# EAGLE design PoppingUnit (EAGLE 6.5.0)
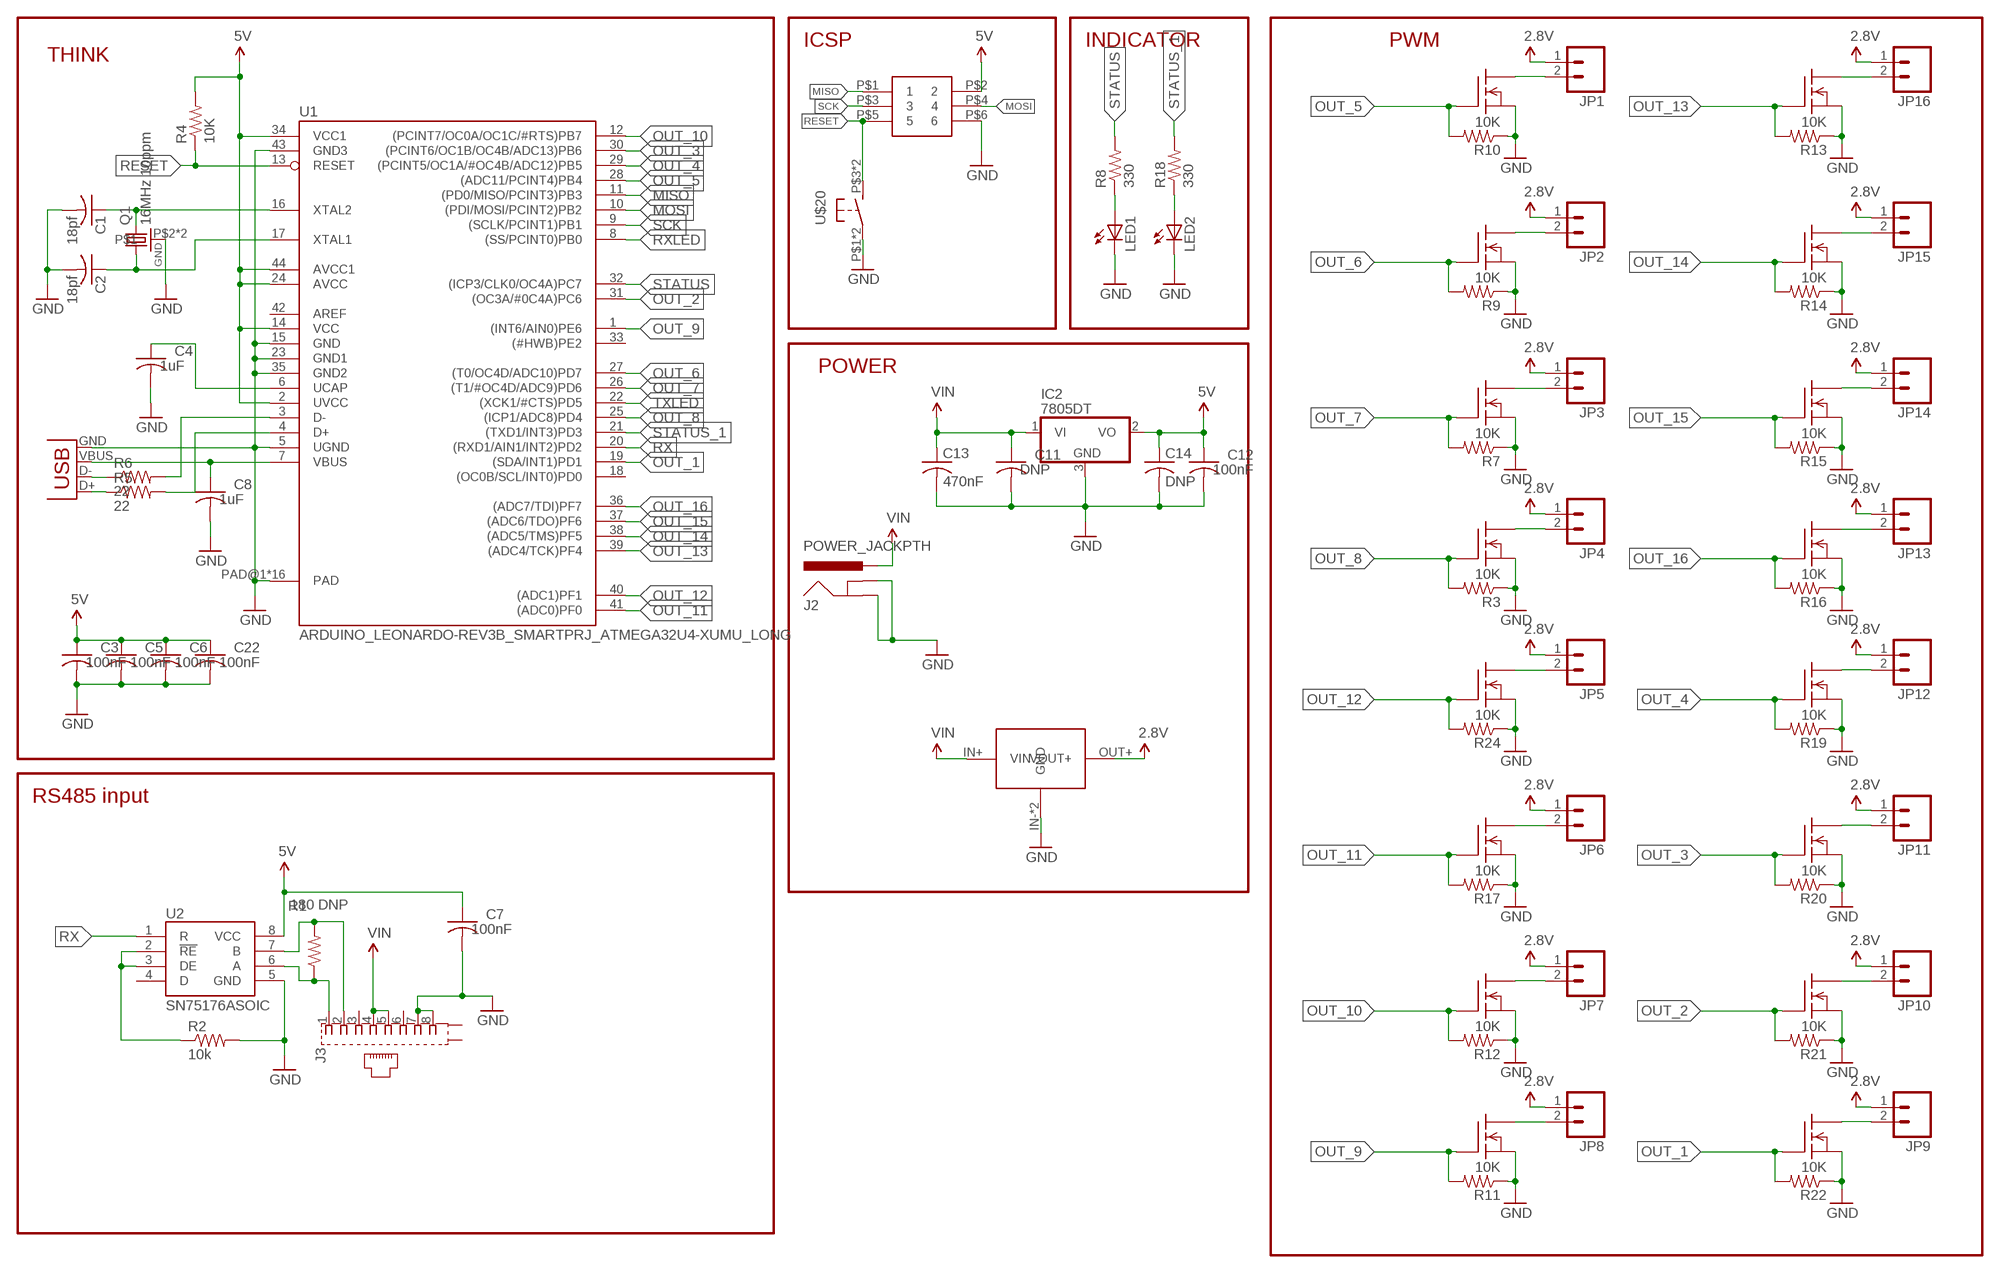
[diagram p0: schematic, sheet 1]

## Parts
C1  18pf  C-USC0603K  [C0603K]
C2  18pf  C-USC0603K  [C0603K]
C3  100nF  C-USC0603K  [C0603K]
C4  1uF  C-USC0603K  [C0603K]
C5  100nF  C-USC0603K  [C0603K]
C6  100nF  C-USC0603K  [C0603K]
C7  100nF  C-USC0603K  [C0603K]
C8  1uF  C-USC0603K  [C0603K]
C11  DNP  C-USC0603K  [C0603K]
C12  100nF  C-USC0603K  [C0603K]
C13  470nF  C-USC0603K  [C0603K]
C14  DNP  C-USC0603K  [C0603K]
C22  100nF  C-USC0603K  [C0603K]
IC2  7805DT  [TO252]
J2  POWER_JACKPTH  [POWER_JACK_PTH]
J3  555153-1  [555153-1]
JP1  M02-JST-2-PTH-NO_SILK  [JST-2-PTH-NS]
JP2  M02-JST-2-PTH-NO_SILK  [JST-2-PTH-NS]
JP3  M02-JST-2-PTH-NO_SILK  [JST-2-PTH-NS]
JP4  M02-JST-2-PTH-NO_SILK  [JST-2-PTH-NS]
JP5  M02-JST-2-PTH-NO_SILK  [JST-2-PTH-NS]
JP6  M02-JST-2-PTH-NO_SILK  [JST-2-PTH-NS]
JP7  M02-JST-2-PTH-NO_SILK  [JST-2-PTH-NS]
JP8  M02-JST-2-PTH-NO_SILK  [JST-2-PTH-NS]
JP9  M02-JST-2-PTH-NO_SILK  [JST-2-PTH-NS]
JP10  M02-JST-2-PTH-NO_SILK  [JST-2-PTH-NS]
JP11  M02-JST-2-PTH-NO_SILK  [JST-2-PTH-NS]
JP12  M02-JST-2-PTH-NO_SILK  [JST-2-PTH-NS]
JP13  M02-JST-2-PTH-NO_SILK  [JST-2-PTH-NS]
JP14  M02-JST-2-PTH-NO_SILK  [JST-2-PTH-NS]
JP15  M02-JST-2-PTH-NO_SILK  [JST-2-PTH-NS]
JP16  M02-JST-2-PTH-NO_SILK  [JST-2-PTH-NS]
LED1  LED5MM  [LED5MM]
LED2  LED5MM  [LED5MM]
Q1  16MHz 10ppm  CRYSTAL_4PAD2520  [CRSYTAL_2520]
R1  180 DNP  R-US_R0603  [R0603]
R2  10k  R-US_R0603  [R0603]
R3  10K  R-US_R0603  [R0603]
R4  10K  R-US_R0603  [R0603]
R5  22  R-US_R0603  [R0603]
R6  22  R-US_R0603  [R0603]
R7  10K  R-US_R0603  [R0603]
R8  330  R-US_R0603  [R0603]
R9  10K  R-US_R0603  [R0603]
R10  10K  R-US_R0603  [R0603]
R11  10K  R-US_R0603  [R0603]
R12  10K  R-US_R0603  [R0603]
R13  10K  R-US_R0603  [R0603]
R14  10K  R-US_R0603  [R0603]
R15  10K  R-US_R0603  [R0603]
R16  10K  R-US_R0603  [R0603]
R17  10K  R-US_R0603  [R0603]
R18  330  R-US_R0603  [R0603]
R19  10K  R-US_R0603  [R0603]
R20  10K  R-US_R0603  [R0603]
R21  10K  R-US_R0603  [R0603]
R22  10K  R-US_R0603  [R0603]
R24  10K  R-US_R0603  [R0603]
U1  ARDUINO_LEONARDO-REV3B_SMARTPRJ_ATMEGA32U4-XUMU_LONG  [QFN44ML7X7_LONGLEADS]
U2  SN75176ASOIC  [SO08]
U$1  N_MOSFET  [TO252]
U$2  2X3HEADER  [2X3HEADER]
U$3  N_MOSFET  [TO252]
U$4  N_MOSFET  [TO252]
U$5  N_MOSFET  [TO252]
U$6  N_MOSFET  [TO252]
U$7  N_MOSFET  [TO252]
U$8  N_MOSFET  [TO252]
U$9  N_MOSFET  [TO252]
U$10  N_MOSFET  [TO252]
U$11  N_MOSFET  [TO252]
U$12  N_MOSFET  [TO252]
U$14  N_MOSFET  [TO252]
U$15  N_MOSFET  [TO252]
U$16  N_MOSFET  [TO252]
U$17  N_MOSFET  [TO252]
U$18  N_MOSFET  [TO252]
U$19  DC_DC  [DSN2596]
U$20  BUTTON_MOMENTARY  [BUTTON_MOMENTARY_KMR211G]
X1  USBPTH  [USB-B-PTH]

## Nets
2.8V: JP1.1 JP2.1 JP3.1 JP4.1 JP5.1 JP6.1 JP7.1 JP8.1 JP9.1 JP10.1 JP11.1 JP12.1 JP13.1 JP14.1 JP15.1 JP16.1 U$19.OUT+(VOUT+)
5V: C3.1 C5.1 C6.1 C7.1 C12.1 C14.1 C22.1 IC2.2(VO) R4.2 U1.2(UVCC) U1.14(VCC) U1.24(AVCC) U1.34(VCC1) U1.44(AVCC1) U2.8(VCC) U$2.P$2
CONNECT_ME: R2.1 U2.2(!RE) U2.3(DE)
GND [power]: C1.2 C2.2 C3.2 C4.2 C5.2 C6.2 C7.2 C8.2 C11.2 C12.2 C13.2 C14.2 C22.2 IC2.3(GND) J2.GND J2.GNDBREAK J3.7 J3.8 LED1.K(C) LED2.K(C) Q1.P$2 Q1.P$4 R2.2 R3.1 R7.1 R9.1 R10.1 R11.1 R12.1 R13.1 R14.1 R15.1 R16.1 R17.1 R19.1 R20.1 R21.1 R22.1 R24.1 U1.5(UGND) U1.15(GND) U1.23(GND1) U1.35(GND2) U1.43(GND3) U1.PAD@1(PAD) U1.PAD@2(PAD) U1.PAD@3(PAD) U1.PAD@4(PAD) U1.PAD@5(PAD) U1.PAD@6(PAD) U1.PAD@7(PAD) U1.PAD@8(PAD) U1.PAD@9(PAD) U1.PAD@10(PAD) U1.PAD@11(PAD) U1.PAD@12(PAD) U1.PAD@13(PAD) U1.PAD@14(PAD) U1.PAD@15(PAD) U1.PAD@16(PAD) U2.5(GND) U$1.P$2(S) U$2.P$6 U$3.P$2(S) U$4.P$2(S) U$5.P$2(S) U$6.P$2(S) U$7.P$2(S) U$8.P$2(S) U$9.P$2(S) U$10.P$2(S) U$11.P$2(S) U$12.P$2(S) U$14.P$2(S) U$15.P$2(S) U$16.P$2(S) U$17.P$2(S) U$18.P$2(S) U$19.IN-(GND) U$19.OUT-(GND) U$20.P$1(P) U$20.P$2(P) X1.GND
MISO: U1.11((PD0/MISO/PCINT3)PB3) U$2.P$1
MOSI: U1.10((PDI/MOSI/PCINT2)PB2) U$2.P$4
N$1: R6.1 X1.D-
N$2: C1.1 Q1.P$3 U1.16(XTAL2)
N$3: R5.1 X1.D+
N$4: R5.2 U1.4(D+)
N$5: C2.1 Q1.P$1 U1.17(XTAL1)
N$6: R6.2 U1.3(D-)
N$7: C8.1 U1.7(VBUS) X1.VBUS
N$8: LED1.A R8.1
N$9: C4.1 U1.6(UCAP)
N$10: JP11.2 U$16.P$3(D)
N$11: JP1.2 U$1.P$3(D)
N$12: LED2.A R18.1
N$22: JP2.2 U$3.P$3(D)
N$23: JP3.2 U$4.P$3(D)
N$24: JP4.2 U$5.P$3(D)
N$25: JP5.2 U$10.P$3(D)
N$26: JP6.2 U$11.P$3(D)
N$27: JP7.2 U$12.P$3(D)
N$28: JP8.2 U$14.P$3(D)
N$29: JP9.2 U$18.P$3(D)
N$30: JP10.2 U$17.P$3(D)
N$32: JP12.2 U$15.P$3(D)
N$33: JP13.2 U$9.P$3(D)
N$34: JP14.2 U$8.P$3(D)
N$35: JP15.2 U$7.P$3(D)
N$36: JP16.2 U$6.P$3(D)
OUT_1: R22.2 U1.19((SDA/INT1)PD1) U$18.P$1(G)
OUT_2: R21.2 U1.31((OC3A/#0C4A)PC6) U$17.P$1(G)
OUT_3: R20.2 U1.30((PCINT6/OC1B/OC4B/ADC13)PB6) U$16.P$1(G)
OUT_4: R19.2 U1.29((PCINT5/OC1A/#OC4B/ADC12)PB5) U$15.P$1(G)
OUT_5: R10.2 U1.28((ADC11/PCINT4)PB4) U$1.P$1(G)
OUT_6: R9.2 U1.27((T0/OC4D/ADC10)PD7) U$3.P$1(G)
OUT_7: R7.2 U1.26((T1/#OC4D/ADC9)PD6) U$4.P$1(G)
OUT_8: R3.2 U1.25((ICP1/ADC8)PD4) U$5.P$1(G)
OUT_9: R11.2 U1.1((INT6/AIN0)PE6) U$14.P$1(G)
OUT_10: R12.2 U1.12((PCINT7/OC0A/OC1C/#RTS)PB7) U$12.P$1(G)
OUT_11: R17.2 U1.41((ADC0)PF0) U$11.P$1(G)
OUT_12: R24.2 U1.40((ADC1)PF1) U$10.P$1(G)
OUT_13: R13.2 U1.39((ADC4/TCK)PF4) U$6.P$1(G)
OUT_14: R14.2 U1.38((ADC5/TMS)PF5) U$7.P$1(G)
OUT_15: R15.2 U1.37((ADC6/TDO)PF6) U$8.P$1(G)
OUT_16: R16.2 U1.36((ADC7/TDI)PF7) U$9.P$1(G)
RESET: R4.1 U1.13(RESET) U$2.P$5 U$20.P$3(S) U$20.P$4(S)
RS485A: J3.1 R1.1 U2.6(A)
RS485B: J3.2 R1.2 U2.7(B)
RX: U1.20((RXD1/AIN1/INT2)PD2) U2.1(R)
RXLED: U1.8((SS/PCINT0)PB0)
SCK: U1.9((SCLK/PCINT1)PB1) U$2.P$3
STATUS: R8.2 U1.32((ICP3/CLK0/OC4A)PC7)
STATUS_1: R18.2 U1.21((TXD1/INT3)PD3)
TXLED: U1.22((XCK1/#CTS)PD5)
VIN: C11.1 C13.1 IC2.1(VI) J2.PWR J3.4 J3.5 U$19.IN+(VIN)
Unconnected: J3.3 J3.6 J3.G1(S1) J3.G2(S2) U1.18((OC0B/SCL/INT0)PD0) U1.33((#HWB)PE2) U2.4(D)

## Notes on the sheet
- ICSP | INDICATOR | PWM
- THINK
- POWER
- RS485 input

## Power pins joined to a net without a drawn wire
AREF: U1.42(AREF)

## Library data of the parts
C1-C8 C11-C14 C22 = adafruit:C-US: CAPACITOR, American symbol
IC2 = linear:78*: Positive VOLTAGE REGULATOR Source: http://cache.national.com/ds/LM/LM78L05.pdf http://www.fairchildsemi.com/ds/LM/LM7805.pdf
J2 = SparkFun:POWER_JACK: Power Jack This is the standard 5.5mm barrel jack for power. The PTH is the most common, proven, reliable, footprint. All others are experimental. The Slot footprint only works if the mill layer is transmitted to the PCB fab house so be warned. Spark Fun Electronics SKU : PRT-00119. Mating wall wart : TOL-00298 (and others)
J3 = con-amp:555153-1: AMP connector
JP1-JP16 = SparkFun-Connectors:M02: Header 2 Standard 2-pin 0.1" header. Use with straight break away headers (SKU : PRT-00116), right angle break away headers (PRT-00553), swiss pins (PRT-00743), machine pins (PRT-00117), and female headers (PRT-00115). Molex polarized connector foot print use with SKU : PRT-08233 with associated crimp pins and housings.
LED1 LED2 = SparkFun:LED: LEDs Standard schematic elements and footprints for 5mm, 3mm, 1206, and 0603 sized LEDs. 5mm - Spark Fun Electronics SKU : COM-00529 (and others)
Q1 = blinkinlabs:CRYSTAL_4PAD
R1-R22 R24 = adafruit:R-US_: RESISTOR, American symbol
U1 = blinkinlabs:ARDUINO_LEONARDO-REV3B_SMARTPRJ_ATMEGA32U4-XU
U2 = reprap:SN75176A
U$1 U$3-U$12 U$14-U$18 = blinkinlabs:N_MOSFET
U$2 = sonos_library:2X3HEADER
U$19 = blinkinlabs:DC_DC
U$20 = blinkinlabs:BUTTON_MOMENTARY
X1 = SparkFun:USB: USB Connectors USB-B-PTH is fully proven SKU : PRT-00139 USB-miniB is fully proven SKU : PRT-00587 USB-A-PCB is untested. USB-A-H is throughly reviewed, but untested. Spark Fun Electronics SKU : PRT-00437 USB-B-SMT is throughly reviewed, but untested. Needs silkscreen touching up. USB-A-S has not been used/tested USB-MB-H has not been used/tested

## Net classes
0 default: width 0.254 mm
1 power: width 0.406 mm
2 motors: width 0.61 mm

## Board
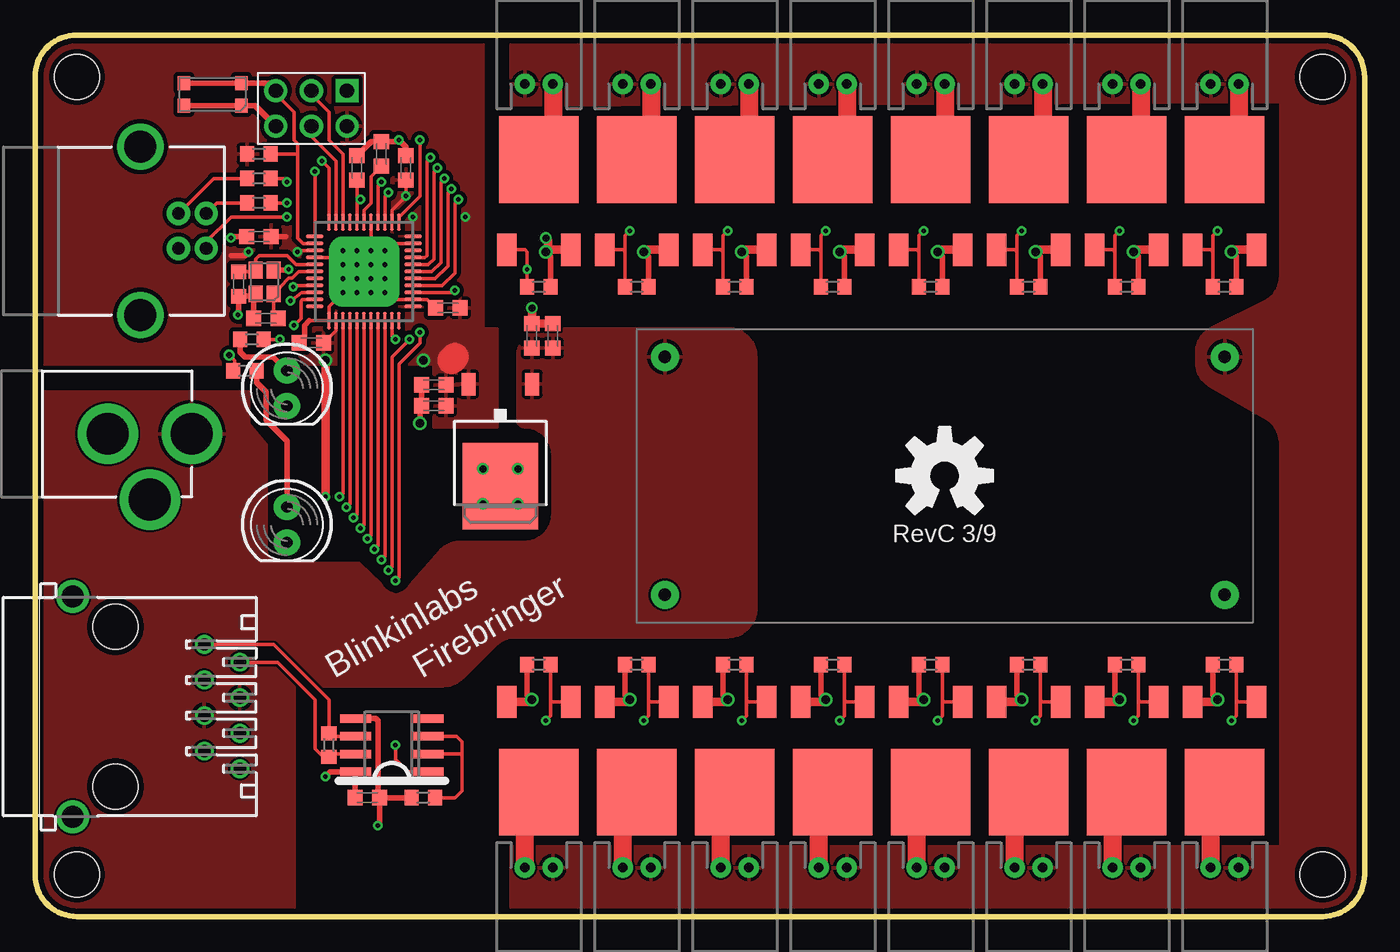
[diagram p1: board, top side]
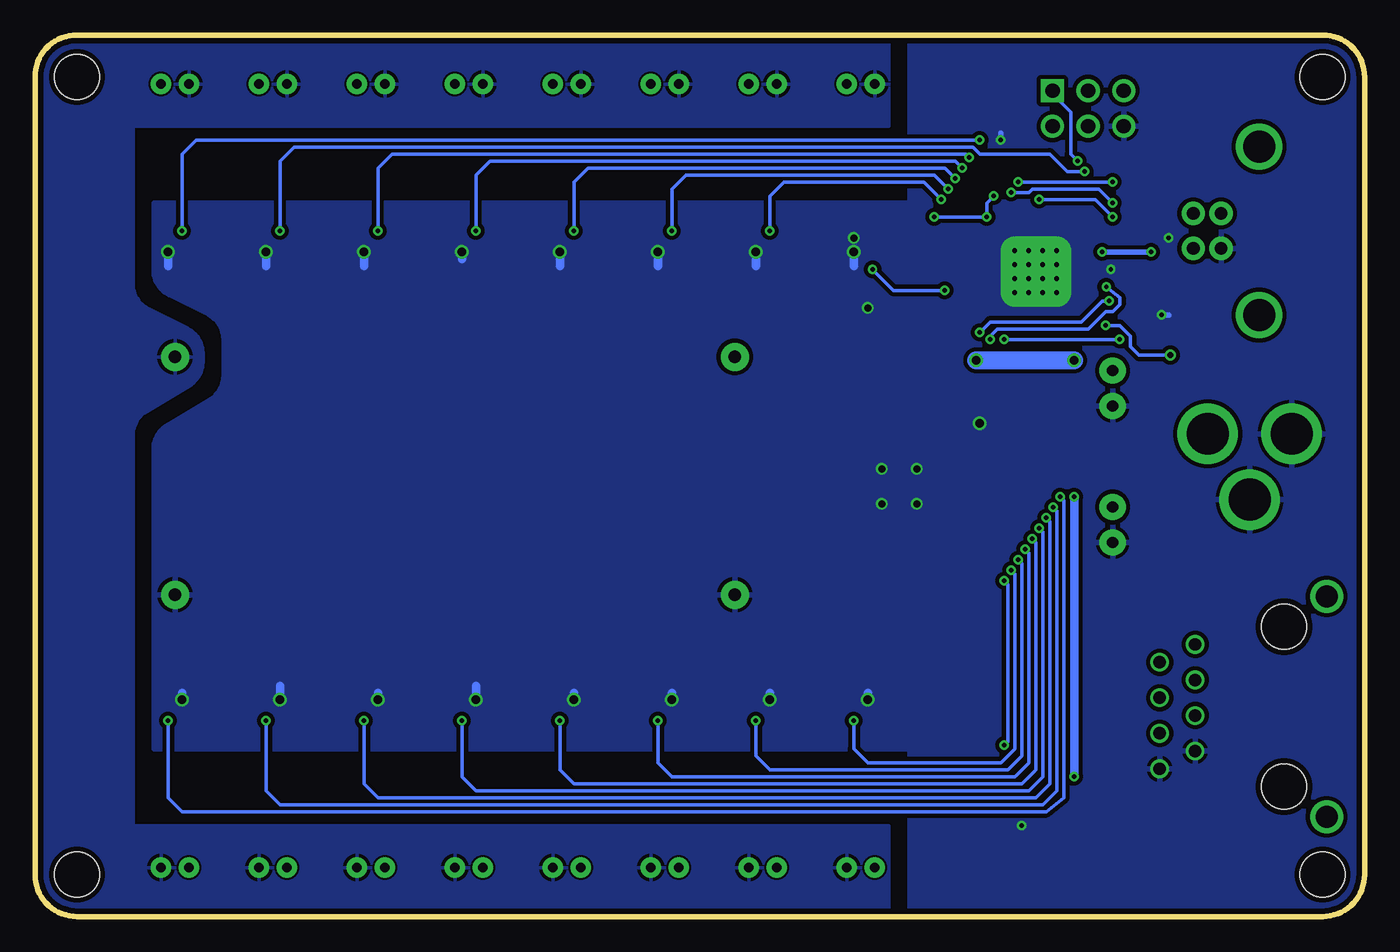
[diagram p2: board, bottom side, seen from below]

Size 95 x 63 mm. Coordinates in mm from the lower left corner, seen from the top.
Outline: 3,63 92,63 arc-90 95,60 95,3 arc-90 92,0 3,0 arc-90 0,3 0,60 arc-90 3,63
Copper layers (1*16): Top 0.0356mm / dielectric 1.5011mm / Bottom 0.0356mm
Design rules "default *": minimum track width 6mil, minimum drill 0.3mm, track to track 6mil, track to pad 6mil, pad to pad 6mil, via to via 6mil, smd to smd 6mil, copper to edge 15mil, drill to drill 6mil, minimum pad ring 7mil, minimum via ring 7mil, stop-mask expansion 4mil, vias tented up to drill 0.3mm, thermal gap 10mil
Holes 3.2 mm at 3,3 3,60 92,60 92,3

### Footprints (pad centres in the part's own frame; a part is rotated, then mirrored left to right if it is on the bottom)
C0603K = smd 1.05 x 1.08: 1 -0.875,0; 2 0.875,0
TO252 = smd 1 x 1.6: 1 -2.28,-4.8; 2 2.28,-4.8 | smd 5.4 x 6.2: 3 0,2.5
POWER_JACK_PTH = drill 2.997 pad 4.318: GND 0,7.7; GNDBREAK 4.7,10.7; PWR 0,13.7
555153-1 = drill 0.889: 1 -4.445,6.35; 2 -3.175,8.89; 3 -1.905,6.35; 4 -0.635,8.89; 5 0.635,6.35; 6 1.905,8.89; 7 3.175,6.35; 8 4.445,8.89 | drill 1.575 pad 2.184: G1 -7.874,-3.048; G2 7.874,-3.048 | hole 3.251: -5.715,0; 5.715,0
JST-2-PTH-NS = drill 0.7 pad 1.448: 1 -1,0; 2 1,0
LED5MM = drill 0.813 pad 1.88: A -1.27,0; K 1.27,0
CRSYTAL_2520 = smd 1.2 x 1: P$1 -0.85,-0.65; P$2 0.85,-0.65; P$3 0.85,0.65; P$4 -0.85,0.65
R0603 = smd 1 x 1.1: 1 -0.85,0; 2 0.85,0
QFN44ML7X7_LONGLEADS = smd 1.25 x 0.275: 1 -3.525,2.5; 2 -3.525,2; 3 -3.525,1.5; 4 -3.525,1; 5 -3.525,0.5; 6 -3.525,0; 7 -3.525,-0.5; 8 -3.525,-1; 9 -3.525,-1.5; 10 -3.525,-2; 11 -3.525,-2.5; 23 3.525,-2.5; 24 3.525,-2; 25 3.525,-1.5; 26 3.525,-1; 27 3.525,-0.5; 28 3.525,0; 29 3.525,0.5; 30 3.525,1; 31 3.525,1.5; 32 3.525,2; 33 3.525,2.5 | smd 0.275 x 1.25: 12 -2.5,-3.525; 13 -2,-3.525; 14 -1.5,-3.525; 15 -1,-3.525; 16 -0.5,-3.525; 17 0,-3.525; 18 0.5,-3.525; 19 1,-3.525; 20 1.5,-3.525; 21 2,-3.525; 22 2.5,-3.525; 34 2.5,3.525; 35 2,3.525; 36 1.5,3.525; 37 1,3.525; 38 0.5,3.525; 39 0,3.525; 40 -0.5,3.525; 41 -1,3.525; 42 -1.5,3.525; 43 -2,3.525; 44 -2.5,3.525 | drill 0.35 pad 2: PAD@1 -1.5,1.5; PAD@4 1.5,1.5; PAD@13 -1.5,-1.5; PAD@16 1.5,-1.5 | drill 0.35 pad 2 square: PAD@2 -0.5,1.5; PAD@3 0.5,1.5; PAD@5 -1.5,0.5; PAD@8 1.5,0.5; PAD@9 -1.5,-0.5; PAD@12 1.5,-0.5; PAD@14 -0.5,-1.5; PAD@15 0.5,-1.5 | drill 0.35 pad 1 square: PAD@6 -0.5,0.5; PAD@7 0.5,0.5; PAD@10 -0.5,-0.5; PAD@11 0.5,-0.5
SO08 = smd 0.6 x 2.2: 1 -1.905,-2.6; 2 -0.635,-2.6; 3 0.635,-2.6; 4 1.905,-2.6; 5 1.905,2.6; 6 0.635,2.6; 7 -0.635,2.6; 8 -1.905,2.6
TO252' = smd 1.4 x 2.3: P$1 -2.285,-3.35; P$2 2.285,-3.35 | smd 5.7 x 6.2: P$3 0,3.1
2X3HEADER = drill 1.016 pad 1.651 square: P$1 -1.27,2.54 | drill 1.016 pad 1.651: P$2 1.27,2.54; P$3 -1.27,0; P$4 1.27,0; P$5 -1.27,-2.54; P$6 1.27,-2.54
DSN2596 = drill 0.9 pad 2: IN+ -20,8.5; IN- -20,-8.5; OUT+ 20,8.5; OUT- 20,-8.5
BUTTON_MOMENTARY_KMR211G = smd 0.9 x 1: P$1 -2,0.8; P$2 2.1,0.8; P$3 -2,-0.8; P$4 2.1,-0.8
USB-B-PTH = drill 0.914 pad 1.676: D+ 0,1.25; D- 1.981,1.25; GND 0,-1.25; VBUS 1.981,-1.25 | drill 2.286: S1 -2.718,-6.02; S2 -2.718,6.02

### Placement (x,y rotation side)
C1  14.55,45.2 270 top
C2  16.5,42.75 180 top
C3  26.5,53.5 90 top
C4  24.75,54.5 90 top
C5  29.5,43.5 180 top
C6  16,48.6 180 top
C7  23.75,8.5 0 top
C8  23,53.5 90 top
C11  37,41.5 90 top
C12  28.5,36.5 180 top
C13  35.5,41.5 90 top
C14  28.5,38 180 top
C22  19.75,41 180 top
IC2  33.25,33.25 180 top
J2  -2.5,34.5 270 top
J3  5.75,15 270 top
JP1  64,3.5 180 top
JP2  71,3.5 180 top
JP3  78,3.5 180 top
JP4  85,3.5 180 top
JP5  64,59.5 0 top
JP6  71,59.5 0 top
JP7  78,59.5 0 top
JP8  85,59.5 0 top
JP9  36,3.5 180 top
JP10  43,3.5 180 top
JP11  50,3.5 180 top
JP12  57,3.5 180 top
JP13  36,59.5 0 top
JP14  43,59.5 0 top
JP15  50,59.5 0 top
JP16  57,59.5 0 top
LED1  18,37.75 270 top
LED2  18,28 270 top
Q1  16.4,45.35 90 top
R1  21,12.25 270 top
R2  27.75,8.5 180 top
R3  85,18 0 top
R4  16,54.5 180 top
R5  16,52.75 0 top
R6  16,51 0 top
R7  78,18 0 top
R8  15.5,41.25 0 top
R9  71,18 0 top
R10  64,18 0 top
R11  85,45 180 top
R12  78,45 180 top
R13  57,45 180 top
R14  50,45 180 top
R15  43,45 180 top
R16  36,45 180 top
R17  71,45 180 top
R18  15,39 180 top
R19  57,18 0 top
R20  50,18 0 top
R21  43,18 0 top
R22  36,18 0 top
R24  64,45 180 top
U1  23.5,46.1 270 top
U2  25.5,12.25 90 top
U$1  N_MOSFET  [TO252']  64,12 180 top
U$2  19.75,57.75 270 top
U$3  N_MOSFET  [TO252']  71,12 180 top
U$4  N_MOSFET  [TO252']  78,12 180 top
U$5  N_MOSFET  [TO252']  85,12 180 top
U$6  N_MOSFET  [TO252']  57,51 0 top
U$7  N_MOSFET  [TO252']  50,51 0 top
U$8  N_MOSFET  [TO252']  43,51 0 top
U$9  N_MOSFET  [TO252']  36,51 0 top
U$10  N_MOSFET  [TO252']  64,51 0 top
U$11  N_MOSFET  [TO252']  71,51 0 top
U$12  N_MOSFET  [TO252']  78,51 0 top
U$13  [OSHW-LOGO-L]  65,31.5 0 top
U$14  N_MOSFET  [TO252']  85,51 0 top
U$15  N_MOSFET  [TO252']  57,12 180 top
U$16  N_MOSFET  [TO252']  50,12 180 top
U$17  N_MOSFET  [TO252']  43,12 180 top
U$18  N_MOSFET  [TO252']  36,12 180 top
U$19  65,31.5 0 top
U$20  12.75,58.75 180 top
X1  10.25,49 0 top

### Tracks (layer width: path | path; a pad name or v marks a point on that pad's centre or on a via)
2.8V
  pour Bottom: 34,63 92,63 arc-90 95,60 95,3 arc-90 92,0 34,0 34,6.5 88,6.5 88,34.37 arc59 87.03,36.08 83.97,37.92 arc-59 83,39.63 83,40.26 arc-63 84.11,42.05 86.89,43.45 arc63 88,45.24 88,56.5 34,56.5
  pour Top: 34,63 92,63 arc-90 95,60 95,3 arc-90 92,0 34,0 34,5 89,5 89,33.85 arc60 88.01,35.58 83.99,37.92 arc-60 83,39.65 83,40.26 arc-63 84.11,42.05 87.89,43.95 arc63 89,45.74 89,58.25 34,58
5V  (via drill 0.3, 0.6)
  Top 0.254: U1.2 25.5,50.5 v26.5,51.5 C3.1 | 18.9,47.6 v18.75,47.5 18.6,47.6 U1.14 | U1.24 21.5,41.88 C22.1
  Top 0.406: v20.75,10 21.09,10.35 U2.8 22.88,10.32 C7.1 | C6.1 17.9,48.6 | v15.25,47.5 15,47.25 14,47.25
  Top 0.61: v20.75,30 v20.75,39.75
  Top 2: 29.75,39.75 30,40
  Bottom 0.254: v26.5,51.5 27,51 v27,50 v30.75,50
  Bottom 0.406: v18.75,47.5 v15.25,47.5
  Bottom 0.61: v20.75,10 v20.75,30
  Bottom 1.27: v20.75,39.75 v27.75,39.75
  pour Top (isolate 0.3): 0,39.5 0,60 arc-90 3,63 32,63 32,42 33,42 33,35 28.5,35 28.5,39.5
CONNECT_ME
  Top 0.254: R2.1 30,8.5 30.5,9 30.5,11.5 | 30.5,11.5 30.5,12.5 30.11,12.88 U2.3 | U2.2 30.39,11.62 30.5,11.5
GND  (via drill 0.3, 0.5, 0.6)
  Top 0.254: U1.43 25.5,48.1 U1.PAD@1 | U1.15 21.5,47.1 U1.PAD@14 | U1.PAD@16 21,43.6 U1.23 19.57,42.58 | U1.PAD@4 25.5,44.1 U1.35 28.02,44.1 C5.2 | U1.5 U1.PAD@5
  Top 0.406: R22.1 35.15,15.85 v35.5,15.5 | R21.1 42.15,15.85 v42.5,15.5 | R20.1 49.15,15.85 v49.5,15.5 | R19.1 56.15,15.85 v56.5,15.5 | R10.1 63.15,15.85 v63.5,15.5 | R9.1 70.15,15.85 v70.5,15.5 | R7.1 77.15,15.85 v77.5,15.5 | R3.1 84.15,15.85 v84.5,15.5 | R11.1 85.85,47.15 v85.5,47.5 | R12.1 78.85,47.15 v78.5,47.5 | R17.1 71.85,47.15 v71.5,47.5 | R24.1 64.85,47.15 v64.5,47.5 | R13.1 57.85,47.15 v57.5,47.5 | R14.1 50.85,47.15 v50.5,47.5 | R15.1 43.85,47.15 v43.5,47.5 | R16.1 36.85,47.15 v36.5,47.5 | C7.2 24.62,6.62 v24.5,6.5 | U2.5 24.34,14.15 24.5,14 24.5,8.62 C7.2 | R2.2 C7.2 | v14.5,43 14.55,43.05 C1.2 15.57,44.33 Q1.P$4 15.62,44.38 C2.2 | Q1.P$2 17.8,46.2 v18.12,46.25 | v34.5,29.5 IC2.3 | C8.2 24,55.38 C4.2 25.88,55.38 v26,55.5 26.5,55 C3.2 | v27.5,35.25 27.5,36.38 C12.2 C14.2 | C6.2 14.1,48.6 v14,48.5 | U$2.P$6 15.74,57.95 U$20.P$1 U$20.P$2 | 19.57,42.58 19.25,42.25 19.25,41.38 C22.2
  Top 0.61: U$8.P$2 43.65,47.65 v43.5,47.5 | U$7.P$2 50.65,47.65 v50.5,47.5 | U$6.P$2 57.65,47.65 v57.5,47.5 | U$10.P$2 64.65,47.65 v64.5,47.5 | U$11.P$2 71.65,47.65 v71.5,47.5 | U$12.P$2 78.65,47.65 v78.5,47.5 | U$14.P$2 85.65,47.65 v85.5,47.5 | U$5.P$2 84.35,15.35 v84.5,15.5 | U$4.P$2 77.35,15.35 v77.5,15.5 | U$3.P$2 70.35,15.35 v70.5,15.5 | U$1.P$2 63.35,15.35 v63.5,15.5 | U$15.P$2 56.35,15.35 v56.5,15.5 | U$16.P$2 49.35,15.35 v49.5,15.5 | U$17.P$2 42.35,15.35 v42.5,15.5 | U$18.P$2 35.35,15.35 v35.5,15.5 | C11.2 C13.2 v35.5,43.5 | 36.65,47.65 36.65,48.35 v36.5,48.5 | U$9.P$2 36.65,47.65 | 36.65,47.65 v36.5,47.5
  Bottom 0.406: v14.5,43 14,43 | v26,55.5 26,56
  Bottom 0.61: v36.5,47.5 36.5,46.5 | v43.5,47.5 43.5,46.5 | v50.5,47.5 50.5,46.5 | v57.5,47.5 57.5,46.5 | v64.5,47.5 64.5,47 | v71.5,47.5 71.5,46.5 | v78.5,47.5 78.5,46.5 | v85.5,47.5 85.5,46.5 | v84.5,15.5 84.5,16 | v77.5,15.5 77.5,16.5 | v70.5,15.5 70.5,16 | v63.5,15.5 63.5,16.5 | v56.5,15.5 56.5,16 | v49.5,15.5 49.5,16 | v42.5,15.5 42.5,16 | v35.5,15.5 35.5,16
  other vias: 32,32 32,29.5 34.5,32
  pour Bottom (isolate 0.3): 32.5,63 3,63 arc90 0,60 0,3 arc90 3,0 32.5,0 32.5,12 86.5,12 86.5,33.37 arc59 85.53,35.08 82.47,36.92 arc-59 81.5,38.63 81.5,41.26 arc-63 82.61,43.05 85.39,44.45 arc63 86.5,46.24 86.5,51 32.5,51
MISO  (via drill 0.3)
  Top 0.254: v20.5,54 21,53.5 U1.11
  Bottom 0.254: U$2.P$1 22.29,58.79 21,57.5 21,54.5 v20.5,54
MOSI
  Top 0.254: U$2.P$4 19.75,55.75 21.5,54 U1.10
N$1
  Top 0.254: R6.1 12.98,51 X1.D-
N$2
  Top 0.254: C1.1 16.12,46.08 Q1.P$3 15.75,47 16,47.25 18,47.25 18.65,46.6 U1.16
N$3
  Top 0.254: R5.1 12.75,52.75 X1.D+
N$4  (via drill 0.3)
  Top 0.254: U1.4 24.5,52.25 v24.75,52.5 | v18,52.5 17.75,52.75 R5.2
  Bottom 0.254: v24.75,52.5 v18,52.5
N$5
  Top 0.254: C2.1 17.05,43.08 Q1.P$1 17.5,44.95 17.5,45 18.12,45.62 18.38,45.62 18.85,46.1 U1.17
N$6  (via drill 0.3)
  Top 0.254: U1.3 25,51.5 v25.25,51.75 | v18,51 R6.2
  Bottom 0.254: v25.25,51.75 24,51.75 23.75,52 19,52 v18,51
N$7  (via drill 0.3)
  Top 0.254: 23,51.25 U1.7 | X1.VBUS 12.23,48.23 14,50 v18,50 | v23.25,51.25 23,51.25 | 23,51.25 C8.1
  Bottom 0.254: v18,50 19.25,51.25 v23.25,51.25
N$8
  Top 0.406: R8.1 14.65,40.35 15,40 17.02,40 LED1.A
N$9
  Top 0.254: U1.6 23.5,50.5 24,51 24,52.88 C4.1
N$10
  Top 1.27: JP11.2 49,7.9 U$16.P$3
N$11
  Top 1.27: JP1.2 63,7.9 U$1.P$3
N$12
  Top 0.406: LED2.A 18,34 16.5,35.5 16.5,37.5 15.85,38.15 R18.1
N$22
  Top 1.27: JP2.2 70,7.9 U$3.P$3
N$23
  Top 1.27: JP3.2 77,7.9 U$4.P$3
N$24
  Top 1.27: JP4.2 84,7.9 U$5.P$3
N$25
  Top 1.27: JP5.2 65,55 64,54 U$10.P$3
N$26
  Top 1.27: JP6.2 72,55.1 U$11.P$3
N$27
  Top 1.27: JP7.2 79,55.1 U$12.P$3
N$28
  Top 1.27: JP8.2 86,55.1 U$14.P$3
N$29
  Top 1.27: JP9.2 35,7.9 U$18.P$3
N$30
  Top 1.27: JP10.2 42,7.9 U$17.P$3
N$32
  Top 1.27: JP12.2 56,7.9 U$15.P$3
N$33
  Top 1.27: JP13.2 37,55.1 U$9.P$3
N$34
  Top 1.27: JP14.2 44,56 42,54 42.9,54 U$8.P$3
N$35
  Top 1.27: JP15.2 51,55.1 U$7.P$3
N$36
  Top 1.27: JP16.2 58,55.1 U$6.P$3
OUT_1  (via drill 0.3)
  Top 0.254: R22.2 36.85,15.5 | 36.85,15.5 36.85,14.35 v36.5,14 | U$18.P$1 37,15.35 36.85,15.5 | v26.75,41.25 25.5,40 25.5,25 v25.25,24.75 | U1.19 18.35,45.1 v18.45,45
  Bottom 0.254: v36.5,14 36.5,12 35.5,11 26,11 25,12 25,24.5 v25.25,24.75 | v26.75,41.25 26.75,41.5 26.25,42 19.75,42 18.5,43.25 18,43.25 17.5,43.75 17.5,44.25 v18.45,45
OUT_2  (via drill 0.3)
  Top 0.254: R21.2 43.85,15.5 | 43.85,15.5 43.85,14.35 v43.5,14 | U$17.P$1 44,15.35 43.85,15.5 | U1.31 25,25.75 v24.75,25.5
  Bottom 0.254: v43.5,14 43.5,11.5 42.5,10.5 25.5,10.5 24.5,11.5 24.5,25.25 v24.75,25.5
OUT_3  (via drill 0.3)
  Top 0.254: R20.2 50.85,15.5 | 50.85,15.5 50.85,14.35 v50.5,14 | U$16.P$1 51,15.35 50.85,15.5 | U1.30 24.5,26.5 v24.25,26.25
  Bottom 0.254: v50.5,14 50.5,11 49.5,10 25,10 24,11 24,26 v24.25,26.25
OUT_4  (via drill 0.3)
  Top 0.254: R19.2 57.85,15.5 | 57.85,15.5 57.85,14.35 v57.5,14 | U$15.P$1 58,15.35 57.85,15.5 | U1.29 24,27.25 v23.75,27
  Bottom 0.254: v57.5,14 57.5,10.5 56.5,9.5 24.5,9.5 23.5,10.5 23.5,26.75 v23.75,27
OUT_5  (via drill 0.3)
  Top 0.254: R10.2 64.85,15.5 | 64.85,15.5 64.85,14.35 v64.5,14 | U$1.P$1 65,15.35 64.85,15.5 | U1.28 23.5,28 v23.25,27.75
  Bottom 0.254: v64.5,14 64.5,10 63.5,9 24,9 23,10 23,27.5 v23.25,27.75
OUT_6  (via drill 0.3)
  Top 0.254: R9.2 71.85,15.5 | 71.85,15.5 71.85,14.35 v71.5,14 | U$3.P$1 72,15.35 71.85,15.5 | U1.27 23,28.75 v22.75,28.5
  Bottom 0.254: v71.5,14 71.5,9.5 70.5,8.5 23.5,8.5 22.5,9.5 22.5,28.25 v22.75,28.5
OUT_7  (via drill 0.3)
  Top 0.254: R7.2 78.85,15.5 | 78.85,15.5 78.85,14.35 v78.5,14 | U$4.P$1 79,15.35 78.85,15.5 | U1.26 22.5,29.5 v22.25,29.25
  Bottom 0.254: v78.5,14 78.5,9 77.5,8 23,8 22,9 22,29 v22.25,29.25
OUT_8  (via drill 0.3)
  Top 0.254: R3.2 85.85,15.5 | 85.85,15.5 85.85,14.35 v85.5,14 | U$5.P$1 86,15.35 85.85,15.5 | U1.25 22,30.25 v21.75,30
  Bottom 0.254: v85.5,14 85.5,8.5 84.5,7.5 22.75,7.5 21.5,8.5 21.5,29.75 v21.75,30
OUT_9  (via drill 0.3)
  Top 0.254: R11.2 84.15,47.5 | 84.15,47.5 84.15,48.65 v84.5,49 | U$14.P$1 84,47.65 84.15,47.5 | U1.1 26,50 27.5,51.5 v27.5,55.5
  Bottom 0.254: v84.5,49 84.5,54.5 83.5,55.5 v27.5,55.5
OUT_10  (via drill 0.3)
  Top 0.254: R12.2 77.15,47.5 | 77.15,47.5 77.15,48.65 v77.5,49 | U$12.P$1 77,47.65 77.15,47.5 | v20,53.25 20,48.62 U1.12
  Bottom 0.254: v77.5,49 77.5,54 76.5,55 28,55 27.5,54.5 22.5,54.5 21.25,53.25 v20,53.25
OUT_11  (via drill 0.3)
  Top 0.254: R17.2 70.15,47.5 | 70.15,47.5 70.15,48.65 v70.5,49 | U$11.P$1 70,47.65 70.15,47.5 | U1.41 27.85,47.1 28,47.25 28,54 v28.25,54.25
  Bottom 0.254: v70.5,49 70.5,53.5 69.5,54.5 28.5,54.5 v28.25,54.25
OUT_12  (via drill 0.3)
  Top 0.254: R24.2 63.15,47.5 | 63.15,47.5 63.15,48.65 v63.5,49 | U$10.P$1 63,47.65 63.15,47.5 | U1.40 28.1,46.6 28.5,47 28.5,53.25 v28.75,53.5
  Bottom 0.254: v63.5,49 63.5,53 62.5,54 29.25,54 v28.75,53.5
OUT_13  (via drill 0.3)
  Top 0.254: R13.2 56.15,47.5 | 56.15,47.5 56.15,48.65 v56.5,49 | U$6.P$1 56,47.65 56.15,47.5 | v29.25,52.75 29,52.5 29,46.75 28.35,46.1 U1.39
  Bottom 0.254: v56.5,49 56.5,52.5 55.5,53.5 30,53.5 v29.25,52.75
OUT_14  (via drill 0.3)
  Top 0.254: R14.2 49.15,47.5 | 49.15,47.5 49.15,48.65 v49.5,49 | U$7.P$1 49,47.65 49.15,47.5 | v29.75,52 29.5,51.75 29.5,46.5 28.6,45.6 U1.38
  Bottom 0.254: v49.5,49 49.5,52 48.5,53 30.75,53 v29.75,52
OUT_15  (via drill 0.3)
  Top 0.254: R15.2 42.15,47.5 | 42.15,47.5 42.15,48.65 v42.5,49 | U$8.P$1 42,47.65 42.15,47.5 | v30.25,51.25 30,51 30,46 29.1,45.1 U1.37
  Bottom 0.254: v42.5,49 42.5,51.5 41.5,52.5 31.5,52.5 v30.25,51.25
OUT_16  (via drill 0.3)
  Top 0.254: U$9.P$1 35,47.65 35.15,47.5 v35.15,46.25 R16.2 | U1.36 29.85,44.6 v30,44.75
  Bottom 0.254: v30,44.75 33.65,44.75 v35.15,46.25
RESET
  Top 0.254: U$2.P$5 17.21,58.79 18.5,57.5 18.5,55.5 18.75,55.25 18.75,54.5 | 18.75,54.5 18.75,48.5 19.15,48.1 U1.13 | R4.1 18.75,54.5
  Top 0.406: U$2.P$5 16.68,59.55 U$20.P$3 U$20.P$4
RS485A
  Top 0.254: U2.6 21.46,12.88 R1.1 21,15.5 17.05,19.45 J3.1
RS485B
  Top 0.254: U2.7 21.46,11.62 R1.2 20.6,11.4 20,12 20,15.5 17.32,18.18 J3.2
RX  (via drill 0.3)
  Top 0.254: U2.1 26.66,10.35 25.75,11.25 v25.75,12.25 | U1.20 19.05,44.6 v18.25,44 | v27.5,41.75 27.5,41 26,39.5 26,24.25 v25.75,24
  Bottom 0.254: v25.75,12.25 25.5,12.5 25.5,23.75 v25.75,24 | v27.5,41.75 26.75,42.5 20.25,42.5 18.75,44 v18.25,44
SCK
  Top 0.254: U$2.P$3 19.75,58.75 21,57.5 21,55.5 22,54.5 U1.9
STATUS  (via drill 0.3)
  Top 0.254: v17.5,41.25 R8.2 | U1.32 25.5,41.5 v25.75,41.25
  Bottom 0.254: v25.75,41.25 v17.5,41.25
STATUS_1  (via drill 0.3, 0.4)
  Top 0.254: v13.88,40.12 14.25,39.75 14.25,39.1 R18.2 | U1.21 19.1,44.1 19,44 19,42.75 v18.5,42.25
  Bottom 0.254: v13.88,40.12 16.12,40.12 16.75,40.75 16.75,41.5 17.5,42.25 v18.5,42.25
VIN
  pour Top: 18.5,0 3,0 arc-90 0,3 0,37.5 15.25,37.5 15.25,35.25 16.5,33.75 16.5,26.25 arc90 17.5,25.25 21.25,25.25 23.14,25.22 24.65,23.81 arc53 25.76,23 25.84,23 arc49 26.85,23.69 28.9,26.06 arc-49 30.41,26.75 35,26.75 arc90 37,28.75 37,33 arc90 35,35 arc-90 34.5,35.5 34.5,40 arc-90 36.5,42 49.5,42 arc-90 51.5,40 51.5,22 arc-90 49.5,20 34.33,20 arc45 32.91,19.41 30.59,17.09 arc-45 29.17,16.5 18.5,16.5

### Text on the board
tNames: RevC 3/9 | Blinkinlabs | Firebringer